# Altium schematic sheet Power.SchDoc
size A4; SheetNumber: 3; SheetTotal: 8
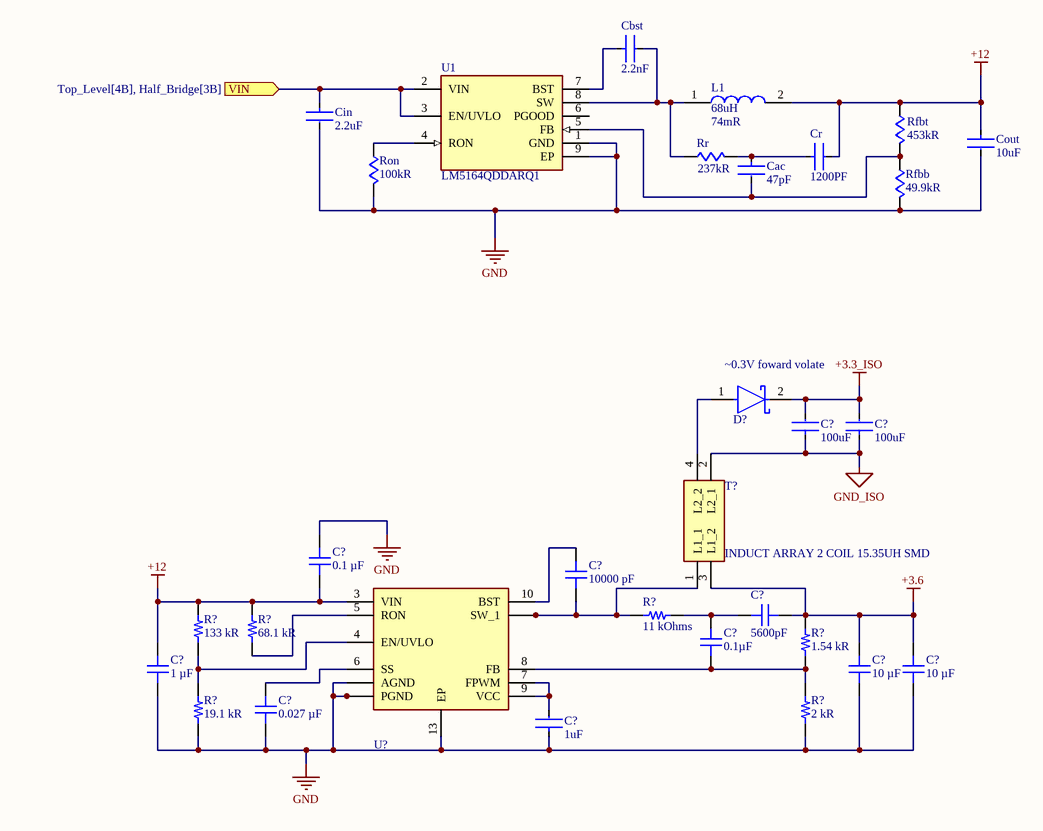
[diagram p0: Power.SchDoc]

## Parts
(Parts that share a designator on the sheet are numbered #1, #2 ... from top to bottom, then left to right.)
C?#1  value 100uF  [CAP 1210_3225 - 2.5MM]  (hidden comment: CAP CER 100UF 6.3V X6S 1210)
C?#2  value 100uF  [CAP 1210_3225 - 2.5MM]  (hidden comment: CAP CER 100UF 6.3V X6S 1210)
C?#3  0.1 µF  [CAP 0603_1608]
C?#4  10000 pF  [CAP 0402_1005]
C?#5  5600pF  [CAP 1206_3216 - 1.8MM]
C?#6  0.1µF  [CAP 0805_2012]
C?#7  1 µF  [CAP 0402_1005]
C?#8  10 µF  [CAP 0805_2012]
C?#9  10 µF  [CAP 0805_2012]
C?#10  0.027 µF  [CAP 0402_1005]
C?#11  value 1uF  [FP-CGA3E-0_3-0_1-IPC_C]  (hidden comment: CER 1UF 16V X7R 0603)
Cac  value 47pF  [FP-CL21-IPC_C]  (hidden comment: CER 47PF 50V C0G/NP0 0805)
Cbst  value 2.2nF  [FP-CL21-IPC_C]  (hidden comment: CER 2200PF 50V X7R 0805)
Cin  value 2.2uF  [FP-GCJ32D-0_4-IPC_C]  (hidden comment: SCER 2.2UF 100V X7R 1210)
Cout  value 10uF  [FP-CL31-IPC_C]  (hidden comment: SCER 10UF 25V X7R 1206)
Cr  value 1200PF  [FP-GCM155-0_05-IPC_C]  (hidden comment: CER 1200PF 50V X7R 0402)
D?  DIODE SCHOTTKY 30V 2A M-FLAT  [FP-M-FLAT-MFG]  (value not drawn)
L1  DC Resistance (DCR): 74mR  Inductance-Nom (L): 68uH  (hidden comment: 68uH Shld 20% 4.3A 84mOhms AECQ2)
R?#1  11 kOhms  [RES 1206_3216]
R?#2  133 kR  [RES 0402_1005]
R?#3  68.1 kR  [RES 0402_1005]
R?#4  1.54 kR  [RES 0805_2012]
R?#5  19.1 kR  [RES 0402_1005]
R?#6  2 kR  [RES 0402_1005]
Rfbb  value 49.9kR  [FP-RMCF0603-IPC_C]  (hidden comment: RES 49.9K OHM 1% 1/10W 0603)
Rfbt  value 453kR  [FP-RMCF0603-IPC_C]  (hidden comment: RES 453K OHM 1% 1/10W 0603)
Ron  value 100kR  [FP-CRCW0805-e3-IPC_C]  (hidden comment: RES SMD 100K OHM 1% 1/8W 0805)
Rr  value 237kR  [FP-CRCW0805-e3-IPC_C]  (hidden comment: RES SMD 237K OHM 1% 1/8W 0805)
T?  INDUCT ARRAY 2 COIL 15.35UH SMD  [DRQ125150R]
U1  LM5164QDDARQ1  [FP-DDA0008A-IPC_C]
U?  IC REG BUCK FLYBCK ADJ 12WSON  [SON50P400X400X100-13N]  (value not drawn)

## Ports
VIN (in, see Top_Level[4B], Half_Bridge[3B])

## Nets
+3.3_ISO: C?#1.2 C?#2.2 D?.2(C)
+3.6: C?#5.2 C?#8.2 C?#9.2 R?#4.2 T?.3(L1_2)
+12: C?#3.1 C?#7.2 Cout.1 Cr.2 L1.2 R?#2.2 R?#3.2 Rfbt.1 U?.3(VIN)
GND: C?#3.2 C?#7.1 C?#8.1 C?#9.1 C?#10.2 C?#11.1 Cin.2 Cout.2 R?#5.1 R?#6.1 Rfbb.2 Ron.2 U1.1(GND) U1.9(EP) U?.1(AGND) U?.2(PGND) U?.3(PGND) U?.13(EP)
GND_ISO: C?#1.1 C?#2.1 T?.2(L2_1)
VIN: Cin.1 U1.2(VIN) U1.3(EN/UVLO) ; port VIN
NetC?#4_1: C?#4.1 R?#1.1 T?.1(L1_1) U?.11(SW_1) U?.12(SW_2)
NetC?#4_2: C?#4.2 U?.10(BST)
NetC?#5_1: C?#5.1 C?#6.2 R?#1.2
NetC?#6_1: C?#6.1 R?#4.1 R?#6.2 U?.8(FB)
NetC?#10_1: C?#10.1 U?.6(SS)
NetC?#11_2: C?#11.2 U?.7(FPWM) U?.9(VCC)
NetCac_1: Cac.1 Cr.1 Rr.2
NetCac_2: Cac.2 Rfbb.1 Rfbt.2 U1.5(FB)
NetCbst_1: Cbst.1 U1.7(BST)
NetCbst_2: Cbst.2 L1.1 Rr.1 U1.8(SW)
NetD?_1: D?.1(A) T?.4(L2_2)
NetR?#2_1: R?#2.1 R?#5.2 U?.4(EN/UVLO)
NetR?#3_1: R?#3.1 U?.5(RON)
NetRon_1: Ron.1 U1.4(RON)

Not connected (* = marked no-connect by the designer): U1 6(PGOOD)

## Notes on the sheet
- (near D?) ~0.3V foward volate

## Library data of the parts
C?#1 C?#2 = GRM32EC80J107ME20L: Manufacturer: Murata; Dielectric Material: Ceramic; Multilayer: Yes; Tolerance  (fill in as +-): 20%; Supplier: Digi-Key; Supplier Part Number: 490-6533-1-ND; Manufacturer Part Number: GRM32EC80J107ME20L; RoHS: Yes; Category: Ceramic Capacitors; Stock: 98662; Pricing: 1=1.54, 10=1.214, 50=1.0518, 100=0.9101, 500=0.68766 (USD); Mounting Technology: Surface Mount; Pins: 2; Package Shape: Rectangular; Case/Package: 1210; Terminal Finish: Nickel; Min Operating Temperature: -55°C; Max Operating Temperature: 105°C; JESD-609 Code: e3; Capacitor Type: Ceramic; Package Style: SMTMeter; Packaging: Tape and Reel; Tolerance (fill in as +-): 20%; Rated DC Voltage (URdc): 6.3V; Temperature Characteristics Code: X6S; Termination: Wraparound; Length: 3.2mm; Width: 2.5mm; Height: 2.5mm; Reach SVHC Compliant: Yes; RoHS Compliant: Yes; ComponentLink1URL: https://psearch.en.murata.com:443/capacitor/product/GRM32EC80J107ME20%23.pdf?src-supplier=IHS+Markit; ComponentLink1Description: https://psearch.en.murata.com:443/capacitor/product/GRM32EC80J107ME20%23.pdf?src-supplier=IHS+Markit; ComponentLink2URL: https://datasheet.ciiva.com/25613/0900766b81023a1e-25613145.pdf?src-supplier=Rs; ComponentLink2Description: https://datasheet.ciiva.com/25613/0900766b81023a1e-25613145.pdf?src-supplier=Rs; ComponentLink3URL: https://datasheet.ciiva.com/7719/1303574-7719173.pdf?src-supplier=Element14; ComponentLink3Description: https://datasheet.ciiva.com/7719/1303574-7719173.pdf?src-supplier=Element14; ComponentLink4URL: https://datasheet.ciiva.com/6264/partnumbering-e-01-6264536.pdf?src-supplier=Digi-Key; ComponentLink4Description: https://datasheet.ciiva.com/6264/partnumbering-e-01-6264536.pdf?src-supplier=Digi-Key; ComponentLink5URL: https://datasheet.ciiva.com/6264/partnumbering-e-01-6264535.pdf?src-supplier=Digi-Key; ComponentLink5Description: https://datasheet.ciiva.com/6264/partnumbering-e-01-6264535.pdf?src-supplier=Digi-Key; ComponentLink6URL: https://datasheet.ciiva.com/6264/partnumbering-e-01-6264537.pdf?src-supplier=Digi-Key; ComponentLink6Description: https://datasheet.ciiva.com/6264/partnumbering-e-01-6264537.pdf?src-supplier=Digi-Key
C?#3 = C0603C104M3VAC7867: CAP CER 0.1UF 25V Y5V 0603; manufacturer: KEMET; Temperature Coefficient: Y5V (F); Tolerance: ±20%; Part Number: C0603C104M3VAC7867; Value: 0.1 µF; Applications: General Purpose; Capacitance: 0.1 µF; componentlink1description: Datasheet; componentlink1url: https://api.kemet.com/component-edge/download/datasheet/C0603C104M3VACTU.pdf; componentlink2description: DigiKey Link; componentlink2url: https://www.digikey.com/en/products/detail/kemet/C0603C104M3VAC7867/411100; Device Package: 0603 (1608 Metric); lastupdated: 2023-06-13 7:44:03 PM; Lifecycle Status: Active; Minimum Order: 1; Mounting Type: Surface Mount, MLCC; Operating Temperature: -30°C ~ 85°C; Package / Case: 0603 (1608 Metric); packaging: TapeAndReel; partid: 35660; Part Status: Active; price: 0.01; series: SMD Comm Y5V; Size / Dimension: 0.063" L x 0.031" W (1.60mm x 0.80mm); Supplier 1: DigiKey; Supplier Part Number 1: 399-C0603C104M3VAC7867CT-ND; Thickness (Max): 0.034" (0.87mm); Voltage - Rated: 25V
C?#4 = GRM155R71H103KA88D: CAP CER 10000PF 50V X7R 0402; manufacturer: Murata Electronics; Tolerance: ±10%; Part Number: GRM155R71H103KA88D; Value: 10000 pF; Applications: General Purpose; Capacitance: 10000 pF; componentlink1description: Datasheet; componentlink1url: https://www.murata.com/~/media/webrenewal/support/library/catalog/products/capacitor/mlcc/c02e.ashx?la=en-us; componentlink2description: DigiKey Link; componentlink2url: https://www.digikey.com/en/products/detail/murata-electronics/GRM155R71H103KA88D/1033252; Device Package: 0402 (1005 Metric); lastupdated: 2023-06-13 7:07:48 PM; Lifecycle Status: Active; Minimum Order: 1; Mounting Type: Surface Mount, MLCC; Operating Temperature: -55°C ~ 125°C; Package / Case: 0402 (1005 Metric); packaging: CutTape; partid: 12559; Part Status: Active; price: 0.01; series: GRM; Size / Dimension: 0.039" L x 0.020" W (1.00mm x 0.50mm); Supplier 1: DigiKey; Supplier Part Number 1: 490-4516-1-ND; Temperature Coefficient: X7R; Thickness (Max): 0.022" (0.55mm); Voltage - Rated: 50V
C?#5 = 12065A562JAT2A: CAP CER 5600PF 50V C0G/NP0 1206; manufacturer: AVX Corporation; Temperature Coefficient: C0G, NP0; Tolerance: ±5%; Part Number: 12065A562JAT2A; Value: 5600pF; Applications: General Purpose; Capacitance: 5600pF; componentlink1description: Datasheet; componentlink1url: http://datasheets.avx.com/C0GNP0-Dielectric.pdf; componentlink2description: DigiKey Link; componentlink2url: http://digikey.com/product-detail/en/avx-corporation/12065A562JAT2A/478-1501-1-ND/564533; Device Package: 1206 (3216 Metric); lastupdated: 2020-09-02 1:05:35 AM; Lifecycle Status: Active; Minimum Order: 1; Mounting Type: Surface Mount, MLCC; Operating Temperature: -55°C ~ 125°C; Package / Case: 1206 (3216 Metric); packaging: TapeAndReel; partid: 21455; Part Status: Active; price: 0.07; series: -; Size / Dimension: 0.126" L x 0.063" W (3.20mm x 1.60mm); Supplier 1: DigiKey; Supplier Part Number 1: 478-1501-1-ND; Thickness (Max): 0.050" (1.27mm); Voltage - Rated: 50V
C?#6 = 08053C104JAZ2A: CAP CER 0.1UF 25V X7R 0805; manufacturer: AVX Corporation; Tolerance: ±5%; Part Number: 08053C104JAZ2A; Value: 0.1µF; Applications: Boardflex Sensitive; Capacitance: 0.1µF; componentlink1description: Datasheet; componentlink1url: http://datasheets.avx.com/FlexitermMLCC.pdf; componentlink2description: DigiKey Link; componentlink2url: http://digikey.com/product-detail/en/avx-corporation/08053C104JAZ2A/478-11877-1-ND/8573513; Device Package: 0805 (2012 Metric); Features: Soft Termination; lastupdated: 2020-09-02 1:04:12 AM; Lifecycle Status: Active; Minimum Order: 1; Mounting Type: Surface Mount, MLCC; Operating Temperature: -55°C ~ 125°C; Package / Case: 0805 (2012 Metric); packaging: TapeAndReel; partid: 16541; Part Status: Active; price: 0.08; series: FLEXITERM®; Size / Dimension: 0.079" L x 0.049" W (2.01mm x 1.25mm); Supplier 1: DigiKey; Supplier Part Number 1: 478-11877-1-ND; Temperature Coefficient: X7R; Thickness (Max): 0.037" (0.94mm); Voltage - Rated: 25V
C?#7 = C1005X5R1V105K050BC: CAP CER 1UF 35V X5R 0402; manufacturer: TDK Corporation; Tolerance: ±10%; Part Number: C1005X5R1V105K050BC; Value: 1 µF; Applications: General Purpose; Capacitance: 1 µF; componentlink1description: Datasheet; componentlink1url: https://product.tdk.com/info/en/catalog/datasheets/mlcc_commercial_general_en.pdf?ref_disty=digikey; componentlink2description: DigiKey Link; componentlink2url: https://www.digikey.com/en/products/detail/tdk-corporation/C1005X5R1V105K050BC/3648589; Device Package: 0402 (1005 Metric); Features: Low ESL; lastupdated: 2023-06-13 7:07:35 PM; Lifecycle Status: Active; Minimum Order: 1; Mounting Type: Surface Mount, MLCC; Operating Temperature: -55°C ~ 85°C; Package / Case: 0402 (1005 Metric); packaging: TapeAndReel; partid: 34317; Part Status: Active; price: 0.02; series: C; Size / Dimension: 0.039" L x 0.020" W (1.00mm x 0.50mm); Supplier 1: DigiKey; Supplier Part Number 1: 445-9073-1-ND; Temperature Coefficient: X5R; Thickness (Max): 0.022" (0.55mm); Voltage - Rated: 35V
C?#8 C?#9 = C0805C106K8PAC7800: CAP CER 10UF 10V X5R 0805; manufacturer: KEMET; Tolerance: ±10%; Part Number: C0805C106K8PAC7800; Value: 10 µF; Applications: Bypass, Decoupling; Capacitance: 10 µF; componentlink1description: Datasheet; componentlink1url: https://connect.kemet.com:7667/gateway/IntelliData-ComponentDocumentation/1.0/download/datasheet/C0805C106K8PACTU; componentlink2description: DigiKey Link; componentlink2url: https://www.digikey.com/en/products/detail/kemet/C0805C106K8PAC7800/1090830; Device Package: 0805 (2012 Metric); lastupdated: 2023-06-14 7:16:14 PM; Lifecycle Status: Active; Minimum Order: 1; Mounting Type: Surface Mount, MLCC; Operating Temperature: -55°C ~ 85°C; Package / Case: 0805 (2012 Metric); packaging: TapeAndReel; partid: 44790; Part Status: Active; price: 0.01; series: SMD Comm X5R; Size / Dimension: 0.079" L x 0.049" W (2.00mm x 1.25mm); Supplier 1: DigiKey; Supplier Part Number 1: 399-C0805C106K8PAC7800CT-ND; Temperature Coefficient: X5R; Thickness (Max): 0.055" (1.40mm); Voltage - Rated: 10V
C?#10 = GCM155R71E273KA55D: CAP CER 0.027UF 25V X7R 0402; manufacturer: Murata Electronics; Tolerance: ±10%; Part Number: GCM155R71E273KA55D; Value: 0.027 µF; Applications: Automotive; Capacitance: 0.027 µF; componentlink1description: Datasheet; componentlink1url: https://search.murata.co.jp/Ceramy/image/img/A01X/G101/ENG/GCM155R71E273KA55-01.pdf; componentlink2description: DigiKey Link; componentlink2url: https://www.digikey.com/en/products/detail/murata-electronics/GCM155R71E273KA55D/7362940; Device Package: 0402 (1005 Metric); lastupdated: 2023-06-13 7:08:24 PM; Lifecycle Status: Active; Minimum Order: 1; Mounting Type: Surface Mount, MLCC; Operating Temperature: -55°C ~ 125°C; Package / Case: 0402 (1005 Metric); packaging: TapeAndReel; partid: 5669; Part Status: Active; price: 0.01; Ratings: AEC-Q200; series: GCM; Size / Dimension: 0.039" L x 0.020" W (1.00mm x 0.50mm); Supplier 1: DigiKey; Supplier Part Number 1: 490-17757-1-ND; Temperature Coefficient: X7R; Thickness (Max): 0.022" (0.55mm); Voltage - Rated: 25V
C?#11 = CGA3E1X7R1C105K080AC: Manufacturer: TDK; Dielectric Material: Ceramic; Multilayer: Yes; Tolerance  (fill in as +-): 10%; Reference Standard: AEC-Q200; Supplier: Digi-Key; Supplier Part Number: 445-12539-1-ND; Manufacturer Part Number: CGA3E1X7R1C105K080AC; RoHS: Yes; Category: Ceramic Capacitors; Stock: 2379528; Pricing: 1=0.12, 10=0.088, 50=0.0498, 100=0.0413, 500=0.02896, 1000=0.02397 (USD); Mounting Technology: Surface Mount; Pins: 2; Package Shape: Rectangular; Case/Package: 0603; Terminal Finish: Nickel; Min Operating Temperature: -55°C; Max Operating Temperature: 125°C; JESD-609 Code: e3; Capacitor Type: Ceramic; Package Style: SMTMeter; Packaging: Tape and Reel; Tolerance (fill in as +-): 10%; Rated DC Voltage (URdc): 16V; Temperature Characteristics Code: X7R; Termination: Wraparound; Length: 1.6mm; Width: 0.8mm; Height: 0.8mm; Reach SVHC Compliant: Yes; RoHS Compliant: Yes; ComponentLink1URL: https://datasheet.ciiva.com:443/pdfs/VipMasterIC/IC/TDKC/TDKC-S-A0008953915/TDKC-S-A0008953915-1.pdf?src-supplier=IHS+Markit; ComponentLink1Description: https://datasheet.ciiva.com:443/pdfs/VipMasterIC/IC/TDKC/TDKC-S-A0008953915/TDKC-S-A0008953915-1.pdf?src-supplier=IHS+Markit; ComponentLink2URL: http://www.farnell.com/datasheets/2292075.pdf?src-supplier=Farnell; ComponentLink2Description: http://www.farnell.com/datasheets/2292075.pdf?src-supplier=Farnell; ComponentLink3URL: https://product.tdk.com/info/en/documents/chara_sheet/CGA3E1X7R1C105K080AC.pdf?src-supplier=Digi-Key; ComponentLink3Description: https://product.tdk.com/info/en/documents/chara_sheet/CGA3E1X7R1C105K080AC.pdf?src-supplier=Digi-Key; ComponentLink4URL: https://product.tdk.com/info/en/catalog/datasheets/mlcc_automotive_general_en.pdf?src-supplier=Digi-Key; ComponentLink4Description: https://product.tdk.com/info/en/catalog/datasheets/mlcc_automotive_general_en.pdf?src-supplier=Digi-Key; ComponentLink5URL: http://product.tdk.com/capacitor/mlcc/en/documents/mlcc_automotive_general_en.pdf?src-supplier=Avnet; ComponentLink5Description: http://product.tdk.com/capacitor/mlcc/en/documents/mlcc_automotive_general_en.pdf?src-supplier=Avnet; ComponentLink6URL: http://www.farnell.com/datasheets/2292075.pdf?src-supplier=Element14; ComponentLink6Description: http://www.farnell.com/datasheets/2292075.pdf?src-supplier=Element14; ComponentLink7URL: http://www.farnell.com/datasheets/2292075.pdf?src-supplier=Newark; ComponentLink7Description: http://www.farnell.com/datasheets/2292075.pdf?src-supplier=Newark; ComponentLink8URL: http://product.tdk.com/capacitor/mlcc/detailed_information.php?lang=en&ref=jp&part_no=CGA3E1X7R1C105K080AC&src-supplier=Mouser; ComponentLink8Description: http://product.tdk.com/capacitor/mlcc/detailed_information.php?lang=en&ref=jp&part_no=CGA3E1X7R1C105K080AC&src-supplier=Mouser
Cac = C0805C470K5GACAUTO: Manufacturer: KEMET; Dielectric Material: Ceramic; Multilayer: Yes; Tolerance  (fill in as +-): 10%; Temperature Characteristics Code: C0G; Reference Standard: AEC-Q200; Supplier: Digi-Key; Supplier Part Number: 399-C0805C470K5GACAUTOCT-ND; Manufacturer Part Number: C0805C470K5GACAUTO; RoHS: Yes; Category: Ceramic Capacitors; Stock: 11331; Pricing: 1=0.15, 10=0.11, 50=0.0626, 100=0.0518, 500=0.03634, 1000=0.03009 (USD); Pins: 2; Case/Package: 0805; Terminal Finish: Nickel; Min Operating Temperature: -55°C; Max Operating Temperature: 125°C; JESD-609 Code: e3; Capacitor Type: Ceramic; Package Style: SMTMeter; Packaging: Tape and Reel; Tolerance (fill in as +-): 10%; Rated DC Voltage (URdc): 50V; Length: 2mm; Width: 1.25mm; Height: 0.78mm; Reach SVHC Compliant: Yes; RoHS Compliant: Yes; ComponentLink1URL: https://datasheet.ciiva.com:443/pdfs/VipMasterIC/IC/KEME/KEME-S-A0008958445/KEME-S-A0008958445-1.pdf?src-supplier=IHS+Markit; ComponentLink1Description: https://datasheet.ciiva.com:443/pdfs/VipMasterIC/IC/KEME/KEME-S-A0008958445/KEME-S-A0008958445-1.pdf?src-supplier=IHS+Markit
Cbst = CL21B222KB6WPNC: Manufacturer: Samsung; Dielectric Material: Ceramic; Multilayer: Yes; Tolerance  (fill in as +-): 10%; Reference Standard: AEC-Q200; Supplier: Digi-Key; Supplier Part Number: 1276-6555-1-ND; Manufacturer Part Number: CL21B222KB6WPNC; RoHS: Yes; Category: Ceramic Capacitors; Stock: 124733; Pricing: 1=0.24, 10=0.161, 50=0.0968, 100=0.0818, 500=0.05596, 1000=0.0495 (USD); Mounting Technology: Surface Mount; Pins: 2; Package Shape: Rectangular; Case/Package: 0805; Terminal Finish: Nickel; Min Operating Temperature: -55°C; Max Operating Temperature: 125°C; JESD-609 Code: e3; Capacitor Type: Ceramic; Packaging: Tape and Reel; Tolerance (fill in as +-): 10%; Rated DC Voltage (URdc): 50V; Temperature Characteristics Code: X7R; Termination: Wraparound; Reach SVHC Compliant: Yes; RoHS Compliant: Yes; ComponentLink1URL: https://datasheet.ciiva.com:443/pdfs/VipMasterIC/IC/SEMS/SEMS-S-A0008886043/SEMS-S-A0008886043-1.pdf?src-supplier=IHS+Markit; ComponentLink1Description: https://datasheet.ciiva.com:443/pdfs/VipMasterIC/IC/SEMS/SEMS-S-A0008886043/SEMS-S-A0008886043-1.pdf?src-supplier=IHS+Markit; ComponentLink2URL: http://www.samsungsem.com/kr/support/library/product-catalog/mlcc.jsp?src-supplier=Digi-Key; ComponentLink2Description: http://www.samsungsem.com/kr/support/library/product-catalog/mlcc.jsp?src-supplier=Digi-Key; ComponentLink3URL: http://www.samsungsem.com/kr/support/product-search/mlcc/CL21B222KB6WPNC.jsp?src-supplier=Digi-Key; ComponentLink3Description: http://www.samsungsem.com/kr/support/product-search/mlcc/CL21B222KB6WPNC.jsp?src-supplier=Digi-Key; ComponentLink4URL: http://www.samsungsem.com/servlet/FileDownload?type=spec&file=CL21B222KB6WPNC.pdf&src-supplier=Avnet; ComponentLink4Description: http://www.samsungsem.com/servlet/FileDownload?type=spec&file=CL21B222KB6WPNC.pdf&src-supplier=Avnet
Cin = GCJ32DR72A225KA01L: CER 2.2UF 100V X7R 1210; Manufacturer: Murata; Dielectric Material: Ceramic; Multilayer: Yes; Tolerance  (fill in as +-): 10%; Reference Standard: AEC-Q200; Supplier: Digi-Key; Supplier Part Number: 490-5840-1-ND; Manufacturer Part Number: GCJ32DR72A225KA01L; RoHS: Yes; Category: Ceramic Capacitors; Stock: 318636; Pricing: 1=1.74, 10=1.375, 50=1.1914, 100=1.031, 500=0.779 (USD); Mounting Technology: Surface Mount; Pins: 2; Package Shape: Rectangular; Case/Package: 1210; Terminal Finish: Nickel; Min Operating Temperature: -55°C; Max Operating Temperature: 125°C; JESD-609 Code: e3; Capacitor Type: Ceramic; Package Style: SMTMeter; Packaging: Tape and Reel; Tolerance (fill in as +-): 10%; Rated DC Voltage (URdc): 100V; Temperature Characteristics Code: X7R; Termination: Wraparound; Length: 3.2mm; Width: 2.5mm; Height: 2mm; Reach SVHC Compliant: Yes; RoHS Compliant: Yes; ComponentLink1URL: https://psearch.en.murata.com:443/capacitor/product/GCJ32DR72A225KA01%23.pdf?src-supplier=IHS+Markit; ComponentLink1Description: https://psearch.en.murata.com:443/capacitor/product/GCJ32DR72A225KA01%23.pdf?src-supplier=IHS+Markit; ComponentLink2URL: https://datasheet.ciiva.com/175/s0717e-175728.pdf?src-supplier=Digi-Key; ComponentLink2Description: https://datasheet.ciiva.com/175/s0717e-175728.pdf?src-supplier=Digi-Key; ComponentLink3URL: https://datasheet.ciiva.com/175/s0717e-175727.pdf?src-supplier=Digi-Key; ComponentLink3Description: https://datasheet.ciiva.com/175/s0717e-175727.pdf?src-supplier=Digi-Key; ComponentLink4URL: https://datasheet.ciiva.com/175/s0717e-175729.pdf?src-supplier=Digi-Key; ComponentLink4Description: https://datasheet.ciiva.com/175/s0717e-175729.pdf?src-supplier=Digi-Key
Cout = CL31B106KAHVPNE: CER 10UF 25V X7R 1206; Manufacturer: Samsung; Dielectric Material: Ceramic; Multilayer: Yes; Tolerance  (fill in as +-): 10%; Reference Standard: AEC-Q200; Supplier: Digi-Key; Supplier Part Number: 1276-6814-1-ND; Manufacturer Part Number: CL31B106KAHVPNE; RoHS: Yes; Category: Ceramic Capacitors; Stock: 960621; Pricing: 1=0.44, 10=0.314, 50=0.2376, 100=0.2069, 500=0.15324, 1000=0.13025 (USD); Mounting Technology: Surface Mount; Pins: 2; Package Shape: Rectangular; Case/Package: 1206; Terminal Finish: Nickel; Min Operating Temperature: -55°C; Max Operating Temperature: 125°C; JESD-609 Code: e3; Capacitor Type: Ceramic; Packaging: Tape and Reel; Tolerance (fill in as +-): 10%; Rated DC Voltage (URdc): 25V; Temperature Characteristics Code: X7R; Termination: Wraparound; Reach SVHC Compliant: Yes; RoHS Compliant: Yes; ComponentLink1URL: https://datasheet.ciiva.com:443/pdfs/VipMasterIC/IC/SEMS/SEMS-S-A0009022704/SEMS-S-A0009023146-1.pdf?src-supplier=IHS+Markit; ComponentLink1Description: https://datasheet.ciiva.com:443/pdfs/VipMasterIC/IC/SEMS/SEMS-S-A0009022704/SEMS-S-A0009023146-1.pdf?src-supplier=IHS+Markit; ComponentLink2URL: http://www.samsungsem.com/kr/support/product-search/mlcc/CL31B106KAHVPNE.jsp?src-supplier=Digi-Key; ComponentLink2Description: http://www.samsungsem.com/kr/support/product-search/mlcc/CL31B106KAHVPNE.jsp?src-supplier=Digi-Key; ComponentLink3URL: http://www.samsungsem.com/kr/support/library/product-catalog/mlcc.jsp?src-supplier=Digi-Key; ComponentLink3Description: http://www.samsungsem.com/kr/support/library/product-catalog/mlcc.jsp?src-supplier=Digi-Key
Cr = GCM155R71H122KA37D
D? = CMS06(TE12L,Q,M): Manufacturer: Toshiba; Diode Element Material: SILICON; Package Body Material: Plastic; Diode Type: RECTIFIER; Forward Voltage: 370mV; Non-rep Pk Forward Current-Max: 40A; Number of Elements: 1; Application(s): GENERAL PURPOSE; Max Reverse Current: 3mA; Supplier: Digi-Key; Supplier Part Number: CMS06QMCT-ND; Manufacturer Part Number: CMS06(TE12L,Q,M); RoHS: No; Category: Rectifier Diodes; Stock: 64445; Pricing: 1=0.54, 10=0.464, 100=0.3461, 500=0.27192, 1000=0.21012 (USD); Pins: 2; Package Shape: Rectangular; Min Operating Temperature: -40°C; Max Operating Temperature: 125°C; Max Output current: 2A; Rep Pk Reverse Voltage-Max: 30V; Surface Mount: Yes; Technology: SCHOTTKY; JESD-30 Code: R-PDSO-F2; Number of Phases: 1; Package Style: SMALL OUTLINEMeter; Terminal Form: Flat; Terminal Position: DUAL; ComponentLink1URL: https://datasheet.ciiva.com:443/pdfs/VipMasterIC/IC/TOSC/TOSCS48988/TOSCS48988-1.pdf?src-supplier=IHS+Markit; ComponentLink1Description: https://datasheet.ciiva.com:443/pdfs/VipMasterIC/IC/TOSC/TOSCS48988/TOSCS48988-1.pdf?src-supplier=IHS+Markit; ComponentLink2URL: https://datasheet.ciiva.com/8281/cms06-datasheet-en-20131101-8281819.pdf?src-supplier=Avnet; ComponentLink2Description: https://datasheet.ciiva.com/8281/cms06-datasheet-en-20131101-8281819.pdf?src-supplier=Avnet; ComponentLink3URL: https://datasheet.ciiva.com/916/dst-cms06-tde-en-1613-916722.pdf?src-supplier=Digi-Key; ComponentLink3Description: https://datasheet.ciiva.com/916/dst-cms06-tde-en-1613-916722.pdf?src-supplier=Digi-Key; ComponentLink4URL: https://datasheet.ciiva.com/916/dst-cms06-tde-en-1613-916723.pdf?src-supplier=Digi-Key; ComponentLink4Description: https://datasheet.ciiva.com/916/dst-cms06-tde-en-1613-916723.pdf?src-supplier=Digi-Key
L1 = MSS1210-683MED: Manufacturer: Coilcraft; Core Material: Ferrite; Case/Size Code: 4848; Inductor Type: GENERAL PURPOSE INDUCTOR; Max Current Rating: 4.9A; Self Resonant Frequency: 4.5MHz; Shielding: Shielded; Package Height: 10mm; Package Length: 12.3mm; Supplier: Mouser; Supplier Part Number: 994-MSS1210-683MED; Manufacturer Part Number: MSS1210-683MED; RoHS: Yes; Category: Fixed Inductors; Stock: 12047; Pricing: 1=3.74, 10=3.74, 50=3.74, 100=3.74, 1000=2.63, 10000=2.63 (USD); Terminal Finish: Nickel; Min Operating Temperature: -40°C; Max Operating Temperature: 85°C; Tolerance: 20%; JESD-609 Code: e3; Construction: Shielded; Manufacturer Series: MSS1210; Package Style: SMTMeter; Packaging: Tape and Reel; Series: MSS1210; Package Width: 12.3mm; Reach SVHC Compliant: Yes; RoHS Compliant: Yes; ComponentLink1URL: https://datasheet.ciiva.com:443/pdfs/VipMasterIC/IC/COLC/COLC-S-A0002292137/COLC-S-A0002292137-1.pdf?src-supplier=IHS+Markit; ComponentLink1Description: https://datasheet.ciiva.com:443/pdfs/VipMasterIC/IC/COLC/COLC-S-A0002292137/COLC-S-A0002292137-1.pdf?src-supplier=IHS+Markit; ComponentLink2URL: https://datasheet.ciiva.com/13283/mss1210-270677-13283815.pdf?src-supplier=Mouser; ComponentLink2Description: https://datasheet.ciiva.com/13283/mss1210-270677-13283815.pdf?src-supplier=Mouser; ComponentLink3URL: https://datasheet.ciiva.com/36858/1681953-36858617.pdf?src-supplier=Element14; ComponentLink3Description: https://datasheet.ciiva.com/36858/1681953-36858617.pdf?src-supplier=Element14; ComponentLink4URL: https://datasheet.ciiva.com/36858/1681953-36858621.pdf?src-supplier=Element14; ComponentLink4Description: https://datasheet.ciiva.com/36858/1681953-36858621.pdf?src-supplier=Element14
R?#1 = RC1206FR-1011KL: RES 11K OHM 1% 1/4W 1206; Manufacturer: Yageo; Power (Watts): 0.25W, 1/4W; Temperature Coefficient: ±100ppm/°C; Part Number: RC1206FR-1011KL; ComponentLink1Description: Datasheet; ComponentLink1URL: https://www.yageo.com/upload/media/product/productsearch/datasheet/rchip/PYu-RC_Group_51_RoHS_L_11.pdf; ComponentLink2Description: DigiKey Link; ComponentLink2URL: https://www.digikey.com/en/products/detail/yageo/RC1206FR-1011KL/14286603; Composition: Thick Film; Device Package: 1206 (3216 Metric); Height - Seated (Max): 0.026" (0.65mm); LastUpdated: 2023-06-14 7:48:06 PM; Lifecycle Status: Active; Minimum Order: 1; Number of Terminations: 2; Operating Temperature: -55°C ~ 155°C; Package / Case: 1206 (3216 Metric); Packaging: TapeAndReel; PartId: 66176; Part Status: Active; Price: 0.01; Resistance: 11 kOhms; Series: RC_L; Size / Dimension: 0.122" L x 0.063" W (3.10mm x 1.60mm); Supplier 1: DigiKey; Supplier Part Number 1: 13-RC1206FR-1011KLCT-ND; Supplier Device Package: 1206; Tolerance: ±1%; Value: 11 kOhms
R?#2 = ERJ-2RKF1333X: RES SMD 133K OHM 1% 1/10W 0402; Manufacturer: Panasonic Electronic Components; Power (Watts): 0.1W, 1/10W; Resistance: 133 kOhms; Temperature Coefficient: ±100ppm/°C; Part Number: ERJ-2RKF1333X; Value: 133 kR; ComponentLink1Description: Datasheet; ComponentLink1URL: https://industrial.panasonic.com/cdbs/www-data/pdf/RDA0000/AOA0000C304.pdf; ComponentLink2Description: DigiKey Link; ComponentLink2URL: https://www.digikey.com/en/products/detail/panasonic-electronic-components/ERJ-2RKF1333X/192126; Composition: Thick Film; Device Package: 0402 (1005 Metric); Features: Automotive AEC-Q200; Height - Seated (Max): 0.016" (0.40mm); LastUpdated: 2023-06-13 8:05:50 PM; Lifecycle Status: Active; Minimum Order: 1; Number of Terminations: 2; Operating Temperature: -55°C ~ 155°C; Package / Case: 0402 (1005 Metric); Packaging: CutTape; PartId: 3621; Part Status: Active; Price: 0.01; Ratings: AEC-Q200; Series: ERJ-2RK; Size / Dimension: 0.039" L x 0.020" W (1.00mm x 0.50mm); Supplier 1: DigiKey; Supplier Part Number 1: P133KLCT-ND; Supplier Device Package: 0402; Tolerance: ±1%
R?#3 = RC0402FR-0768K1L: RES 68.1K OHM 1% 1/16W 0402; Manufacturer: Yageo; Power (Watts): 0.063W, 1/16W; Resistance: 68.1 kOhms; Temperature Coefficient: ±100ppm/°C; Part Number: RC0402FR-0768K1L; Value: 68.1 kR; ComponentLink1Description: Datasheet; ComponentLink1URL: https://www.yageo.com/upload/media/product/productsearch/datasheet/rchip/PYu-RC_Group_51_RoHS_L_10.pdf; ComponentLink2Description: DigiKey Link; ComponentLink2URL: https://www.digikey.com/en/products/detail/yageo/RC0402FR-0768K1L/5281073; Composition: Thick Film; Device Package: 0402 (1005 Metric); Features: Moisture Resistant; Height - Seated (Max): 0.016" (0.40mm); LastUpdated: 2023-06-14 7:29:54 PM; Lifecycle Status: Active; Minimum Order: 1; Number of Terminations: 2; Operating Temperature: -55°C ~ 155°C; Package / Case: 0402 (1005 Metric); Packaging: CutTape; PartId: 2747; Part Status: Active; Price: 0.01; Series: RC_L; Size / Dimension: 0.039" L x 0.020" W (1.00mm x 0.50mm); Supplier 1: DigiKey; Supplier Part Number 1: YAG3213CT-ND; Supplier Device Package: 0402; Tolerance: ±1%
R?#4 = CRCW08051K54FKEA: RES SMD 1.54K OHM 1% 1/8W 0805; Manufacturer: Vishay Dale; Power (Watts): 0.125W, 1/8W; Resistance: 1.54 kOhms; Temperature Coefficient: ±100ppm/°C; Part Number: CRCW08051K54FKEA; Value: 1.54 kR; ComponentLink1Description: Datasheet; ComponentLink1URL: http://www.vishay.com/docs/20035/dcrcwe3.pdf; ComponentLink2Description: DigiKey Link; ComponentLink2URL: https://www.digikey.com/en/products/detail/vishay-dale/CRCW08051K54FKEA/1175656; Composition: Thick Film; Device Package: 0805 (2012 Metric); Features: Automotive AEC-Q200; Height - Seated (Max): 0.020" (0.50mm); LastUpdated: 2023-06-14 7:56:20 PM; Lifecycle Status: Active; Minimum Order: 1; Number of Terminations: 2; Operating Temperature: -55°C ~ 155°C; Package / Case: 0805 (2012 Metric); Packaging: TapeAndReel; PartId: 39717; Part Status: Active; Price: 0.01; Ratings: AEC-Q200; Series: CRCW; Size / Dimension: 0.079" L x 0.049" W (2.00mm x 1.25mm); Supplier 1: DigiKey; Supplier Part Number 1: 541-1.54KCCT-ND; Supplier Device Package: 0805; Tolerance: ±1%
R?#5 = CRCW040219K1FKEDC: RES 19.1K OHM 1% 1/16W 0402; Manufacturer: Vishay Dale; Power (Watts): 0.063W, 1/16W; Resistance: 19.1 kOhms; Temperature Coefficient: ±100ppm/°C; Part Number: CRCW040219K1FKEDC; Value: 19.1 kR; ComponentLink1Description: Datasheet; ComponentLink1URL: https://www.vishay.com/docs/28773/crcwce3.pdf; ComponentLink2Description: DigiKey Link; ComponentLink2URL: https://www.digikey.com/en/products/detail/vishay-dale/CRCW040219K1FKEDC/7925877; Composition: Thick Film; Device Package: 0402 (1005 Metric); Height - Seated (Max): 0.014" (0.35mm); LastUpdated: 2023-06-13 8:04:31 PM; Lifecycle Status: Active; Minimum Order: 1; Number of Terminations: 2; Operating Temperature: -55°C ~ 155°C; Package / Case: 0402 (1005 Metric); Packaging: CutTape; PartId: 69376; Part Status: Active; Price: 0.01; Series: CRCW-C; Size / Dimension: 0.039" L x 0.020" W (1.00mm x 0.50mm); Supplier 1: DigiKey; Supplier Part Number 1: 541-4765-1-ND; Supplier Device Package: 0402; Tolerance: ±1%
R?#6 = CRCW04022K00FKED: RES SMD 2K OHM 1% 1/16W 0402; Manufacturer: Vishay Dale; Power (Watts): 0.063W, 1/16W; Resistance: 2 kOhms; Temperature Coefficient: ±100ppm/°C; Part Number: CRCW04022K00FKED; Value: 2 kR; ComponentLink1Description: Datasheet; ComponentLink1URL: http://www.vishay.com/docs/20035/dcrcwe3.pdf; ComponentLink2Description: DigiKey Link; ComponentLink2URL: https://www.digikey.com/en/products/detail/vishay-dale/CRCW04022K00FKED/1178039; Composition: Thick Film; Device Package: 0402 (1005 Metric); Features: Automotive AEC-Q200; Height - Seated (Max): 0.016" (0.40mm); LastUpdated: 2023-06-13 8:05:26 PM; Lifecycle Status: Active; Minimum Order: 1; Number of Terminations: 2; Operating Temperature: -55°C ~ 155°C; Package / Case: 0402 (1005 Metric); Packaging: CutTape; PartId: 11957; Part Status: Active; Price: 0.01; Ratings: AEC-Q200; Series: CRCW; Size / Dimension: 0.039" L x 0.020" W (1.00mm x 0.50mm); Supplier 1: DigiKey; Supplier Part Number 1: 541-2.00KLCT-ND; Supplier Device Package: 0402; Tolerance: ±1%
Rfbb = RMCF0603FT49K9: RES 49.9K OHM 1% 1/10W 0603, Thick Film; Manufacturer: Stackpole Electronics; Power: 100mW; Rated Temperature: 70°C; Temperature Coefficient: 100ppm/°C; Working Voltage: 75V; Package Height: 0.45mm; Package Length: 1.55mm; Package Width: 0.8mm; Reference Standard: AEC-Q200; Supplier: Digi-Key; Supplier Part Number: RMCF0603FT49K9CT-ND; Manufacturer Part Number: RMCF0603FT49K9; RoHS: Yes; Category: Chip SMD Resistors; Stock: 1459059; Pricing: 1=0.1, 10=0.015, 50=0.009, 100=0.0075, 500=0.00498, 1000=0.00425 (USD); Mounting Technology: Surface Mount; Pins: 2; Package Shape: Rectangular; Case/Package: 0603; Terminal Finish: Nickel; Min Operating Temperature: -55°C; Max Operating Temperature: 155°C; Tolerance: 1%; JESD-609 Code: e3; Resistor Type: FIXED RESISTOR; Construction: Rectangular; Package Style: SMTMeter; Packaging: Tape and Reel; Technology: METAL GLAZE/THICK FILM; Termination: Wraparound; Reach SVHC Compliant: Yes; RoHS Compliant: Yes; ComponentLink1URL: https://datasheet.ciiva.com:443/pdfs/VipMasterIC/IC/SEIE/SEIE-S-A0009541969/SEIE-S-A0009541969-1.pdf?src-supplier=IHS+Markit; ComponentLink1Description: https://datasheet.ciiva.com:443/pdfs/VipMasterIC/IC/SEIE/SEIE-S-A0009541969/SEIE-S-A0009541969-1.pdf?src-supplier=IHS+Markit; ComponentLink2URL: https://datasheet.ciiva.com/15193/getdatasheetpartid-363153-15193484.pdf?src-supplier=Verical; ComponentLink2Description: https://datasheet.ciiva.com/15193/getdatasheetpartid-363153-15193484.pdf?src-supplier=Verical
Rfbt = RMCF0603FT453K: RES 453K OHM 1% 1/10W 0603, Thick Film; Manufacturer: Stackpole Electronics; Power: 100mW; Rated Temperature: 70°C; Temperature Coefficient: 100ppm/°C; Working Voltage: 75V; Package Height: 0.45mm; Package Length: 1.55mm; Package Width: 0.8mm; Reference Standard: AEC-Q200; Supplier: Digi-Key; Supplier Part Number: RMCF0603FT453KCT-ND; Manufacturer Part Number: RMCF0603FT453K; RoHS: Yes; Category: Chip SMD Resistors; Stock: 185042; Pricing: 1=0.1, 10=0.015, 50=0.009, 100=0.0075, 500=0.00498, 1000=0.00425 (USD); Mounting Technology: Surface Mount; Pins: 2; Package Shape: Rectangular; Case/Package: 0603; Terminal Finish: Nickel; Min Operating Temperature: -55°C; Max Operating Temperature: 155°C; Tolerance: 1%; JESD-609 Code: e3; Resistor Type: FIXED RESISTOR; Construction: Rectangular; Package Style: SMTMeter; Packaging: Tape and Reel; Technology: METAL GLAZE/THICK FILM; Termination: Wraparound; Reach SVHC Compliant: Yes; RoHS Compliant: Yes; ComponentLink1URL: https://datasheet.ciiva.com:443/pdfs/VipMasterIC/IC/SEIE/SEIE-S-A0009541969/SEIE-S-A0009541969-1.pdf?src-supplier=IHS+Markit; ComponentLink1Description: https://datasheet.ciiva.com:443/pdfs/VipMasterIC/IC/SEIE/SEIE-S-A0009541969/SEIE-S-A0009541969-1.pdf?src-supplier=IHS+Markit; ComponentLink2URL: https://www.seielect.com/Catalog/SEI-RMCF_RMCP.pdf?src-supplier=Digi-Key; ComponentLink2Description: https://www.seielect.com/Catalog/SEI-RMCF_RMCP.pdf?src-supplier=Digi-Key; ComponentLink3URL: https://www.seielect.com/catalog/SEI-RMCF_RMCP.pdf?src-supplier=Avnet; ComponentLink3Description: https://www.seielect.com/catalog/SEI-RMCF_RMCP.pdf?src-supplier=Avnet
Ron = CRCW0805100KFKEA: RES SMD 100K OHM 1% 1/8W 0805, Thick Film; Manufacturer: Vishay; Power: 125mW; Rated Temperature: 70°C; Temperature Coefficient: 100ppm/°C; Working Voltage: 150V; Package Height: 0.45mm; Package Length: 2mm; Package Width: 1.25mm; Reference Standard: AEC-Q200; Supplier: Digi-Key; Supplier Part Number: 541-100KCCT-ND; Manufacturer Part Number: CRCW0805100KFKEA; RoHS: Yes; Category: Chip SMD Resistors; Stock: 25000; Pricing: 1=0.1, 10=0.059, 50=0.0324, 100=0.0238, 500=0.01454, 1000=0.01071 (USD); Mounting Technology: Surface Mount; Pins: 2; Package Shape: Rectangular; Terminal Finish: Nickel; Case/Package: 0805; Min Operating Temperature: -55°C; Max Operating Temperature: 155°C; Tolerance: 1%; JESD-609 Code: e3; Package Style: SMTMeter; Technology: METAL GLAZE/THICK FILM; Resistor Type: FIXED RESISTOR; Construction: Chip; Packaging: Tape and Reel; Termination: Wraparound; Reach SVHC Compliant: Yes; RoHS Compliant: Yes; ComponentLink1URL: https://datasheet.ciiva.com:443/pdfs/VipMasterIC/IC/VISH/VISH-S-A0007266705/VISH-S-A0007266705-1.pdf?src-supplier=IHS+Markit; ComponentLink1Description: https://datasheet.ciiva.com:443/pdfs/VipMasterIC/IC/VISH/VISH-S-A0007266705/VISH-S-A0007266705-1.pdf?src-supplier=IHS+Markit; ComponentLink2URL: https://datasheet.ciiva.com/16720/70201119-16720891.pdf?src-supplier=Allied+Electronics; ComponentLink2Description: https://datasheet.ciiva.com/16720/70201119-16720891.pdf?src-supplier=Allied+Electronics; ComponentLink3URL: https://datasheet.ciiva.com/16754/70201119-16754822.pdf?src-supplier=Allied+Electronics; ComponentLink3Description: https://datasheet.ciiva.com/16754/70201119-16754822.pdf?src-supplier=Allied+Electronics; ComponentLink4URL: https://datasheet.ciiva.com/7777/1697337-7777349.pdf?src-supplier=Element14; ComponentLink4Description: https://datasheet.ciiva.com/7777/1697337-7777349.pdf?src-supplier=Element14; ComponentLink5URL: https://datasheet.ciiva.com/7777/1720486-7777565.pdf?src-supplier=Element14; ComponentLink5Description: https://datasheet.ciiva.com/7777/1720486-7777565.pdf?src-supplier=Element14; ComponentLink6URL: https://datasheet.ciiva.com/16341/dcrcwe3-16341530.pdf?src-supplier=Future+Electronics; ComponentLink6Description: https://datasheet.ciiva.com/16341/dcrcwe3-16341530.pdf?src-supplier=Future+Electronics
Rr = ERJ-6ENF2373V: RES SMD 237K OHM 1% 1/8W 0805, Thick Film; Manufacturer: Panasonic; Power: 125mW; Rated Temperature: 70°C; Temperature Coefficient: 100ppm/°C; Working Voltage: 150V; Package Height: 0.6mm; Package Length: 2mm; Package Width: 1.25mm; Reference Standard: AEC-Q200; Dielectric Material: Ceramic; Multilayer: Yes; Tolerance  (fill in as +-): 10%; Rated DC Voltage (URdc): 50V; Temperature Characteristics Code: X7R; Supplier: Digi-Key; Supplier Part Number: P237KCCT-ND; Manufacturer Part Number: ERJ-6ENF2373V; RoHS: Yes; Category: Chip SMD Resistors; Stock: 18912; Pricing: 1=0.1, 10=0.086, 50=0.0462, 100=0.033, 500=0.02046, 1000=0.01452 (USD); Mounting Technology: Surface Mount; Pins: 2; Package Shape: Rectangular; Case/Package: 0805; Terminal Finish: Nickel; Min Operating Temperature: -55°C; Max Operating Temperature: 155°C; Tolerance: 1%; JESD-609 Code: e3; Resistor Type: FIXED RESISTOR; Construction: Rectangular; Package Style: SMTMeter; Packaging: Tape and Reel; Technology: METAL GLAZE/THICK FILM; Termination: Wraparound; Reach SVHC Compliant: Yes; RoHS Compliant: Yes; ComponentLink1URL: https://datasheet.ciiva.com:443/pdfs/VipMasterIC/IC/PANA/PANA-S-A0009889626/PANA-S-A0009889626-1.pdf?src-supplier=IHS+Markit; ComponentLink1Description: https://datasheet.ciiva.com:443/pdfs/VipMasterIC/IC/PANA/PANA-S-A0009889626/PANA-S-A0009889626-1.pdf?src-supplier=IHS+Markit; ComponentLink2URL: https://datasheet.ciiva.com/46420/1678782-46420316.pdf?src-supplier=Element14; ComponentLink2Description: https://datasheet.ciiva.com/46420/1678782-46420316.pdf?src-supplier=Element14; ComponentLink3URL: https://datasheet.ciiva.com/30140/aoa0000ce2-30140440.pdf?src-supplier=Onlinecomponents.com; ComponentLink3Description: https://datasheet.ciiva.com/30140/aoa0000ce2-30140440.pdf?src-supplier=Onlinecomponents.com; Capacitor Type: Ceramic; Tolerance (fill in as +-): 10%; Length: 1mm; Width: 0.5mm; Height: 0.5mm; ComponentLink4URL: https://datasheet.ciiva.com:443/pdfs/VipMasterIC/IC/MURE/MURE-S-A0004370842/MURE-S-A0004373045-1.pdf?src-supplier=IHS+Markit; ComponentLink4Description: https://datasheet.ciiva.com:443/pdfs/VipMasterIC/IC/MURE/MURE-S-A0004370842/MURE-S-A0004373045-1.pdf?src-supplier=IHS+Markit; ComponentLink5URL: http://search.murata.co.jp/Ceramy/image/img/A01X/G101/ENG/GCM155R71H122KA37-01.pdf?src-supplier=Digi-Key; ComponentLink5Description: http://search.murata.co.jp/Ceramy/image/img/A01X/G101/ENG/GCM155R71H122KA37-01.pdf?src-supplier=Digi-Key
T? = DRQ125-150-R
U1 = LM5164QDDARQ1: Buck Switching Regulator IC Positive Adjustable 1.2V 1 Output 1A 8-PowerSOIC (0.154", 3.90mm Width); Manufacturer: Texas Instruments; Supplier: Digi-Key; Supplier Part Number: 296-LM5164QDDARQ1CT-ND; Manufacturer Part Number: LM5164QDDARQ1; RoHS: Yes; Category: Voltage Regulators - Switching; Stock: 10636; Pricing: 1=4.55, 10=4.086, 25=3.8632, 100=3.3482, 250=3.17648, 500=2.85024, 1000=2.40381 (USD); Throw Configuration: SWITCHING REGULATOR; Reach SVHC Compliant: Yes; RoHS Compliant: Yes; ComponentLink1URL: https://www.ti.com:443/lit/ds/symlink/lm5164-q1.pdf?src-supplier=IHS+Markit; ComponentLink1Description: https://www.ti.com:443/lit/ds/symlink/lm5164-q1.pdf?src-supplier=IHS+Markit
U? = LM5160DNTR: Manufacturer: Texas Instruments; Package Body Material: Plastic; Throw Configuration: SWITCHING REGULATOR; Control Technique: PULSE WIDTH MODULATION; Max Supply Voltage: 65V; Min Input Voltage: 4.5V; Nominal Supply Voltage: 24V; Channels: 1; Max Output current: 2.875A; Supplier: Digi-Key; Supplier Part Number: 296-46122-1-ND; Manufacturer Part Number: LM5160DNTR; RoHS: Yes; Category: Voltage Regulators - Switching; Stock: 3822; Pricing: 1=2.37, 10=2.132, 25=2.0112, 100=1.7134, 250=1.60888, 500=1.40776 (USD); Case/Package: HVSON; Pins: 12; Package Shape: Square; Terminal Finish: Tin; Min Operating Temperature: -40°C; Max Operating Temperature: 125°C; JESD-609 Code: e3; Moisture Sensitivity Level: 1; Package Style: SMALL OUTLINE, HEAT SINK/SLUG, VERY THIN PROFILEMeter; Peak Reflow Temperature (Cel): 260°C; Surface Mount: Yes; Switcher Configuration: BUCK; Terminal Form: No Lead; Terminal Position: DUAL; Length: 4mm; Width: 4mm; Height - Seated (Max): 0.8mm; Terminal Pitch: 0.5mm; Temperature Grade: AUTOMOTIVE; Reach SVHC Compliant: Yes; RoHS Compliant: Yes; ComponentLink1URL: https://www.ti.com:443/lit/ds/symlink/lm5160.pdf?src-supplier=IHS+Markit; ComponentLink1Description: https://www.ti.com:443/lit/ds/symlink/lm5160.pdf?src-supplier=IHS+Markit; ComponentLink2URL: http://www.ti.com/general/docs/suppproductinfo.tsp?distId=10&amp;gotoUrl=http%3A%2F%2Fwww.ti.com%2Flit%2Fgpn%2Flm5160&src-supplier=Digi-Key; ComponentLink2Description: http://www.ti.com/general/docs/suppproductinfo.tsp?distId=10&amp;gotoUrl=http%3A%2F%2Fwww.ti.com%2Flit%2Fgpn%2Flm5160&src-supplier=Digi-Key; ComponentLink3URL: http://www.ti.com/lit/pdf/szzy004?src-supplier=Digi-Key; ComponentLink3Description: http://www.ti.com/lit/pdf/szzy004?src-supplier=Digi-Key; ComponentLink4URL: http://www.ti.com/general/docs/lit/getliterature.tsp?genericPartNumber=LM5160A&&fileType=pdf&src-supplier=Avnet; ComponentLink4Description: http://www.ti.com/general/docs/lit/getliterature.tsp?genericPartNumber=LM5160A&&fileType=pdf&src-supplier=Avnet